# Altium schematic sheet MCU.schdoc
size 170 x 124 mm
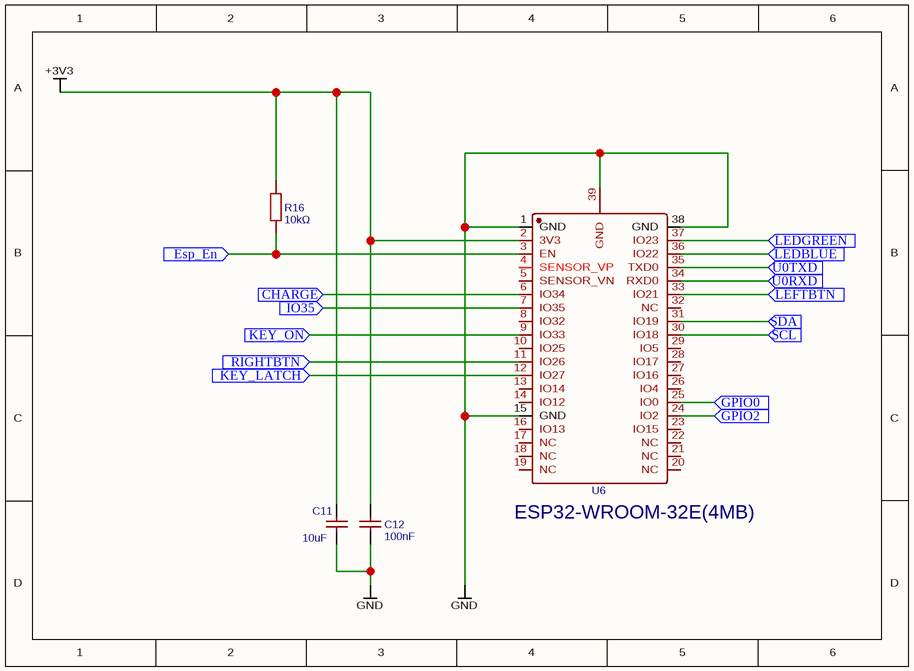
[diagram p0: MCU.schdoc]

## Parts
C11  10uF  [C0603]
C12  100nF  [C0603]
R16  10kΩ  [R0603]
U6  ESP32-WROOM-32E(4MB)  [WIFI-SMD_ESP32-WROOM-32E]

## Ports
CHARGE (in), Esp_En (in), GPIO0 (in), GPIO2 (in), IO35 (in), KEY_LATCH (in), KEY_ON (in), LEDBLUE (in), LEDGREEN (in), LEFTBTN (in), RIGHTBTN (in), SCL (in), SDA (in), U0RXD (in), U0TXD (in)

## Nets
+3V3: C11.2 C12.2 R16.2 U6.2(3V3)
GND: C11.1 C12.1 U6.1(GND) U6.15(GND) U6.38(GND) U6.39(GND)
CHARGE: U6.6(IO34) ; port CHARGE
Esp_En: R16.1 U6.3(EN) ; port Esp_En
GPIO0: U6.25(IO0) ; port GPIO0
GPIO2: U6.24(IO2) ; port GPIO2
IO35: U6.7(IO35) ; port IO35
KEY_LATCH: U6.12(IO27) ; port KEY_LATCH
KEY_ON: U6.9(IO33) ; port KEY_ON
LEDBLUE: U6.36(IO22) ; port LEDBLUE
LEDGREEN: U6.37(IO23) ; port LEDGREEN
LEFTBTN: U6.33(IO21) ; port LEFTBTN
RIGHTBTN: U6.11(IO26) ; port RIGHTBTN
SCL: U6.30(IO18) ; port SCL
SDA: U6.31(IO19) ; port SDA
U0RXD: U6.34(RXD0) ; port U0RXD
U0TXD: U6.35(TXD0) ; port U0TXD

Not connected (* = marked no-connect by the designer): U6 4(SENSOR_VP) 5(SENSOR_VN) 8(IO32) 10(IO25) 13(IO14) 14(IO12) 16(IO13) 17(NC) 18(NC) 19(NC) 20(NC) 21(NC) 22(NC) 23(IO15) 26(IO4) 27(IO16) 28(IO17) 29(IO5) 32(NC)

## Library data of the parts
C11 = 10uF: BOM_Manufacturer: SAMSUNG; BOM_Manufacturer Part: CL10A106MO8NQNC; nameAlias: Capacitance; BOM_Supplier: LCSC; BOM_Supplier Part: C92487; BOM_JLCPCB Part Class: Extended Part; spicePre: C; spiceSymbolName: CL10A106MO8NQNC
C12 = 100nF: BOM_Manufacturer: SAMSUNG; BOM_Manufacturer Part: CL10B104KO8NNNC; nameAlias: Capacitance; BOM_Supplier: LCSC; BOM_Supplier Part: C66501; BOM_JLCPCB Part Class: Extended Part; spicePre: C; spiceSymbolName: CL10B104KO8NNNC
R16 = 10kΩ: BOM_Manufacturer: Guangdong Fenghua Advanced Tech; BOM_Manufacturer Part: RS-03K1002FT; Resistance (Ohms): 10K; nameAlias: Resistance; Contributor: LCSC; BOM_Supplier: LCSC; BOM_Supplier Part: C115324; BOM_JLCPCB Part Class: Extended Part; spicePre: R; spiceSymbolName: RS-03K1002FT
U6 = ESP32-WROOM-32E(4MB): BOM_Manufacturer: Espressif Systems; Contributor: LCSC; BOM_Supplier: LCSC; BOM_Supplier Part: C701341; BOM_Manufacturer Part: ESP32-WROOM-32E(4MB); BOM_JLCPCB Part Class: Extended Part; spicePre: U; spiceSymbolName: ESP32-WROOM-32E(4MB)